# Altium project WaveyRadar.PrjPcb (part 2 of 2)
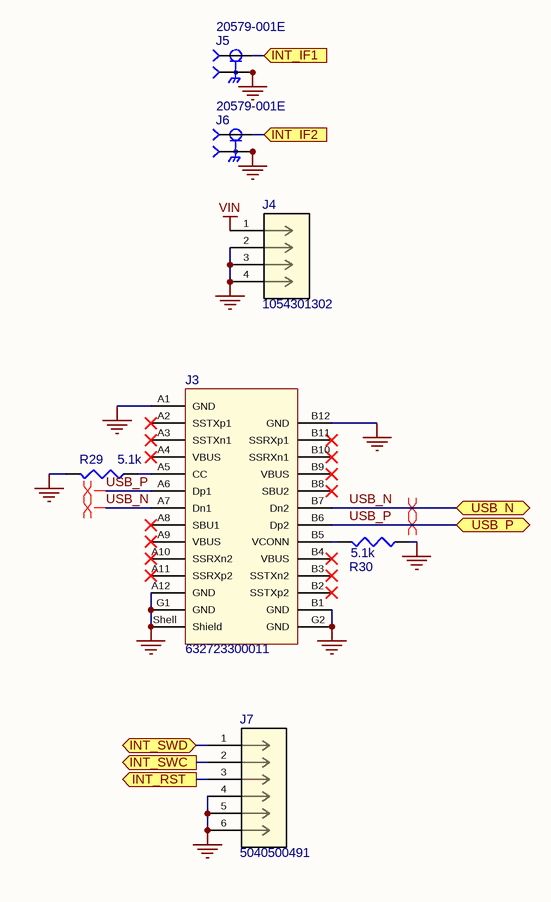
[diagram p15: InterfacesWaveyRadar.SchDoc]

## Nets that join several sheets
1V8: RampPLLWaveyRadar (7 pins), PowerWaveyRadar (C74.1 U15.5)
3V: RampPLLWaveyRadar (8 pins), PowerWaveyRadar (C72.2 U14.5)
3V3: DACWaveyRadar (15 pins), RampPLLWaveyRadar (6 pins), LoopFilterWaveyRadar (R8.2), PowerWaveyRadar (C70.1 U12.5), SwitchBypassWaveyRadar (C25.2 C27.1 IC1.1 IC1.5)
5V: IQDownconverterWaveyRadar (8 pins), IQModulatorWaveyRadar (6 pins), VCOWaveyRadar (9 pins), PowerWaveyRadar (21 pins), TxFrontendWaveyRadar (C59.2 R24.2 U8.7), RxFrontendWaveyRadar (6 pins)
11V: LoopFilterWaveyRadar (U3.5), PowerWaveyRadar (C67.2 R26.2 U10.5)
D3V3: ControllerWaveyRadar (U16.9 U16.30), PowerWaveyRadar (C76.2 U13.5)
GND: ControllerWaveyRadar (9 pins), DACWaveyRadar (26 pins), IQDownconverterWaveyRadar (15 pins), IQModulatorWaveyRadar (20 pins), RampPLLWaveyRadar (27 pins), LoopFilterWaveyRadar (5 pins), VCOWaveyRadar (10 pins), PowerWaveyRadar (19 pins), SplitterWaveyRadar (5 pins), SwitchBypassWaveyRadar (14 pins), TxFrontendWaveyRadar (9 pins), RxFrontendWaveyRadar (9 pins), InterfacesWaveyRadar (21 pins)
VIN: PowerWaveyRadar (7 pins), InterfacesWaveyRadar (J4.1)
D_N: ControllerWaveyRadar (U16.23), InterfacesWaveyRadar (J3.A7 J3.B7)
D_P: ControllerWaveyRadar (U16.24), InterfacesWaveyRadar (J3.A6 J3.B6)
DAC_OUT1_N: DACWaveyRadar (U6.28), IQModulatorWaveyRadar (R17.2 U5.9)
DAC_OUT1_P: DACWaveyRadar (U6.27), IQModulatorWaveyRadar (R18.2 U5.10)
DAC_OUT2_N: DACWaveyRadar (U6.30), IQModulatorWaveyRadar (R16.1 U5.22)
DAC_OUT2_P: DACWaveyRadar (U6.31), IQModulatorWaveyRadar (R15.2 U5.21)
NetA1_1: ReferenceWaveyRadar (A1.1), TxFrontendWaveyRadar (J1.B)
NetA2_1: ReferenceWaveyRadar (A2.1), RxFrontendWaveyRadar (J2.B)
NetC15_2: RampPLLWaveyRadar (U1.24), LoopFilterWaveyRadar (C15.2 R6.1)
NetC16_1: LoopFilterWaveyRadar (C16.1 R7.2), VCOWaveyRadar (U4.29)
NetC26_1: ControllerWaveyRadar (U16.21), SwitchBypassWaveyRadar (C26.1 IC1.2)
NetC28_1: IQModulatorWaveyRadar (C28.1), SplitterWaveyRadar (R11.2 Z1.6)
NetC31_2: IQModulatorWaveyRadar (C31.2), TxFrontendWaveyRadar (U8.2)
NetDC1_6: SwitchBypassWaveyRadar (IC1.12), TxFrontendWaveyRadar (DC1.6)
NetIC1_3: IQDownconverterWaveyRadar (U7.10), SwitchBypassWaveyRadar (IC1.3)
NetIC1_9: SplitterWaveyRadar (R11.1 Z1.4), SwitchBypassWaveyRadar (IC1.9)
NetJ5_1: IQDownconverterWaveyRadar (U7.23), InterfacesWaveyRadar (J5.1)
NetJ6_1: IQDownconverterWaveyRadar (U7.20), InterfacesWaveyRadar (J6.1)
NetJ7_1: ControllerWaveyRadar (U16.32), InterfacesWaveyRadar (J7.1)
NetJ7_2: ControllerWaveyRadar (U16.31), InterfacesWaveyRadar (J7.2)
NetJ7_3: ControllerWaveyRadar (S2.1), InterfacesWaveyRadar (J7.3)
NetR1_1: RampPLLWaveyRadar (R1.1 R2.1), VCOWaveyRadar (U4.19)
NetR12_1: VCOWaveyRadar (U4.12), SplitterWaveyRadar (R12.1 R13.2)
NetU2_11: ControllerWaveyRadar (U16.14), DACWaveyRadar (U6.7), RampPLLWaveyRadar (U2.11)
NetU2_12: ControllerWaveyRadar (U16.15), RampPLLWaveyRadar (U2.12)
NetU2_13: ControllerWaveyRadar (U16.19), RampPLLWaveyRadar (U2.13)
NetU2_14: ControllerWaveyRadar (U16.20), RampPLLWaveyRadar (U2.14)
NetU2_15: ControllerWaveyRadar (U16.13), DACWaveyRadar (U6.2), RampPLLWaveyRadar (U2.15)
NetU2_16: ControllerWaveyRadar (U16.12), DACWaveyRadar (U6.1), RampPLLWaveyRadar (U2.16)
NetU5_1: ControllerWaveyRadar (U16.22), IQModulatorWaveyRadar (U5.1)
NetU6_8: ControllerWaveyRadar (U16.16), DACWaveyRadar (U6.8)
NetU6_9: ControllerWaveyRadar (U16.18), DACWaveyRadar (U6.9)
NetU6_32: ControllerWaveyRadar (U16.17), DACWaveyRadar (U6.32)
NetU7_5: IQDownconverterWaveyRadar (U7.5), RxFrontendWaveyRadar (U9.11)